# EAGLE design WidgetEsp8266RGBv4Panel (EAGLE 9.2.0)
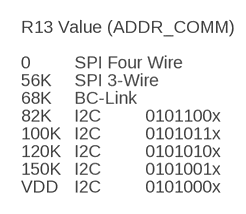
[diagram p0: schematic, sheet 1, part 1 of 3]
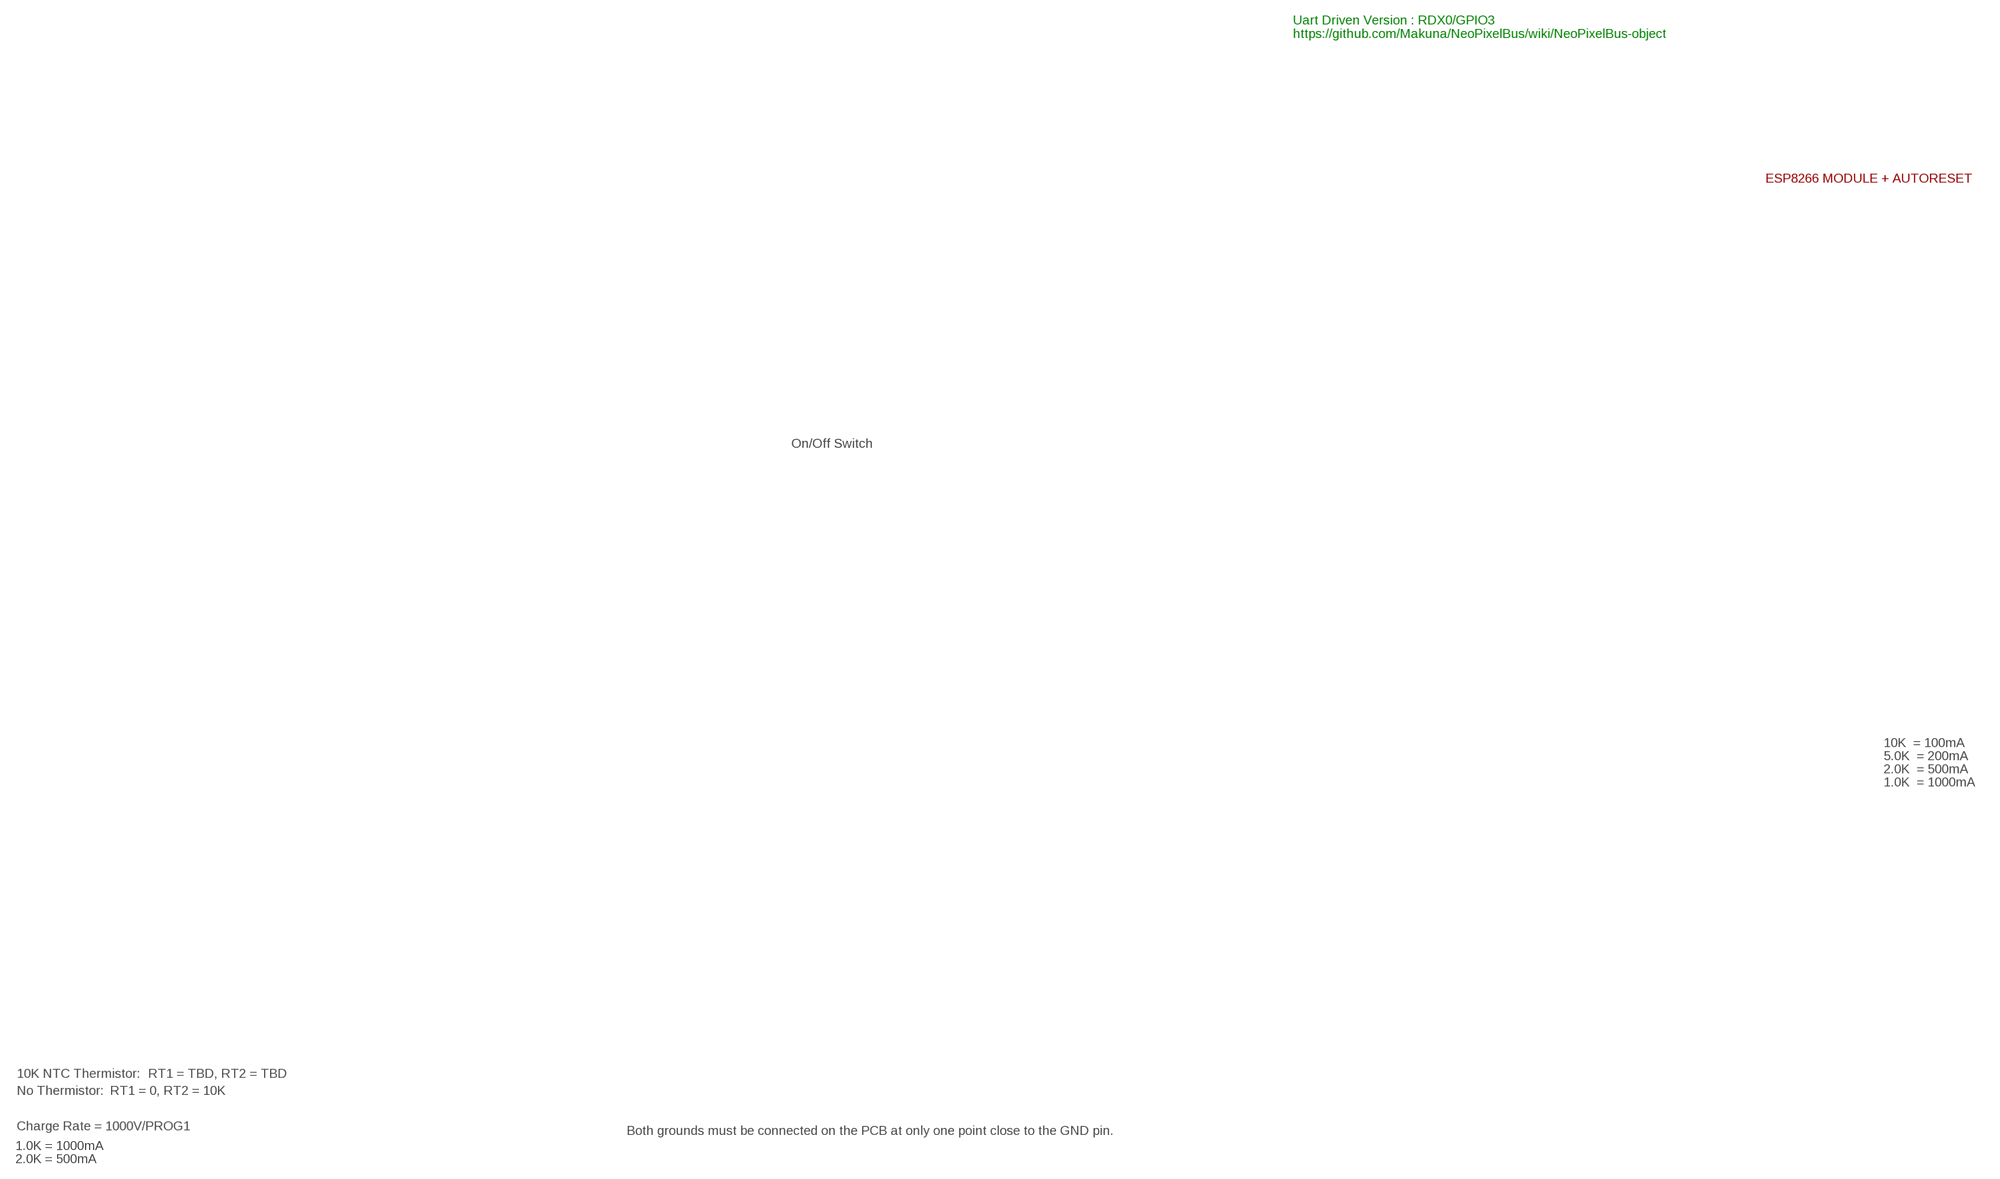
[diagram p1: schematic, sheet 1, part 2 of 3]
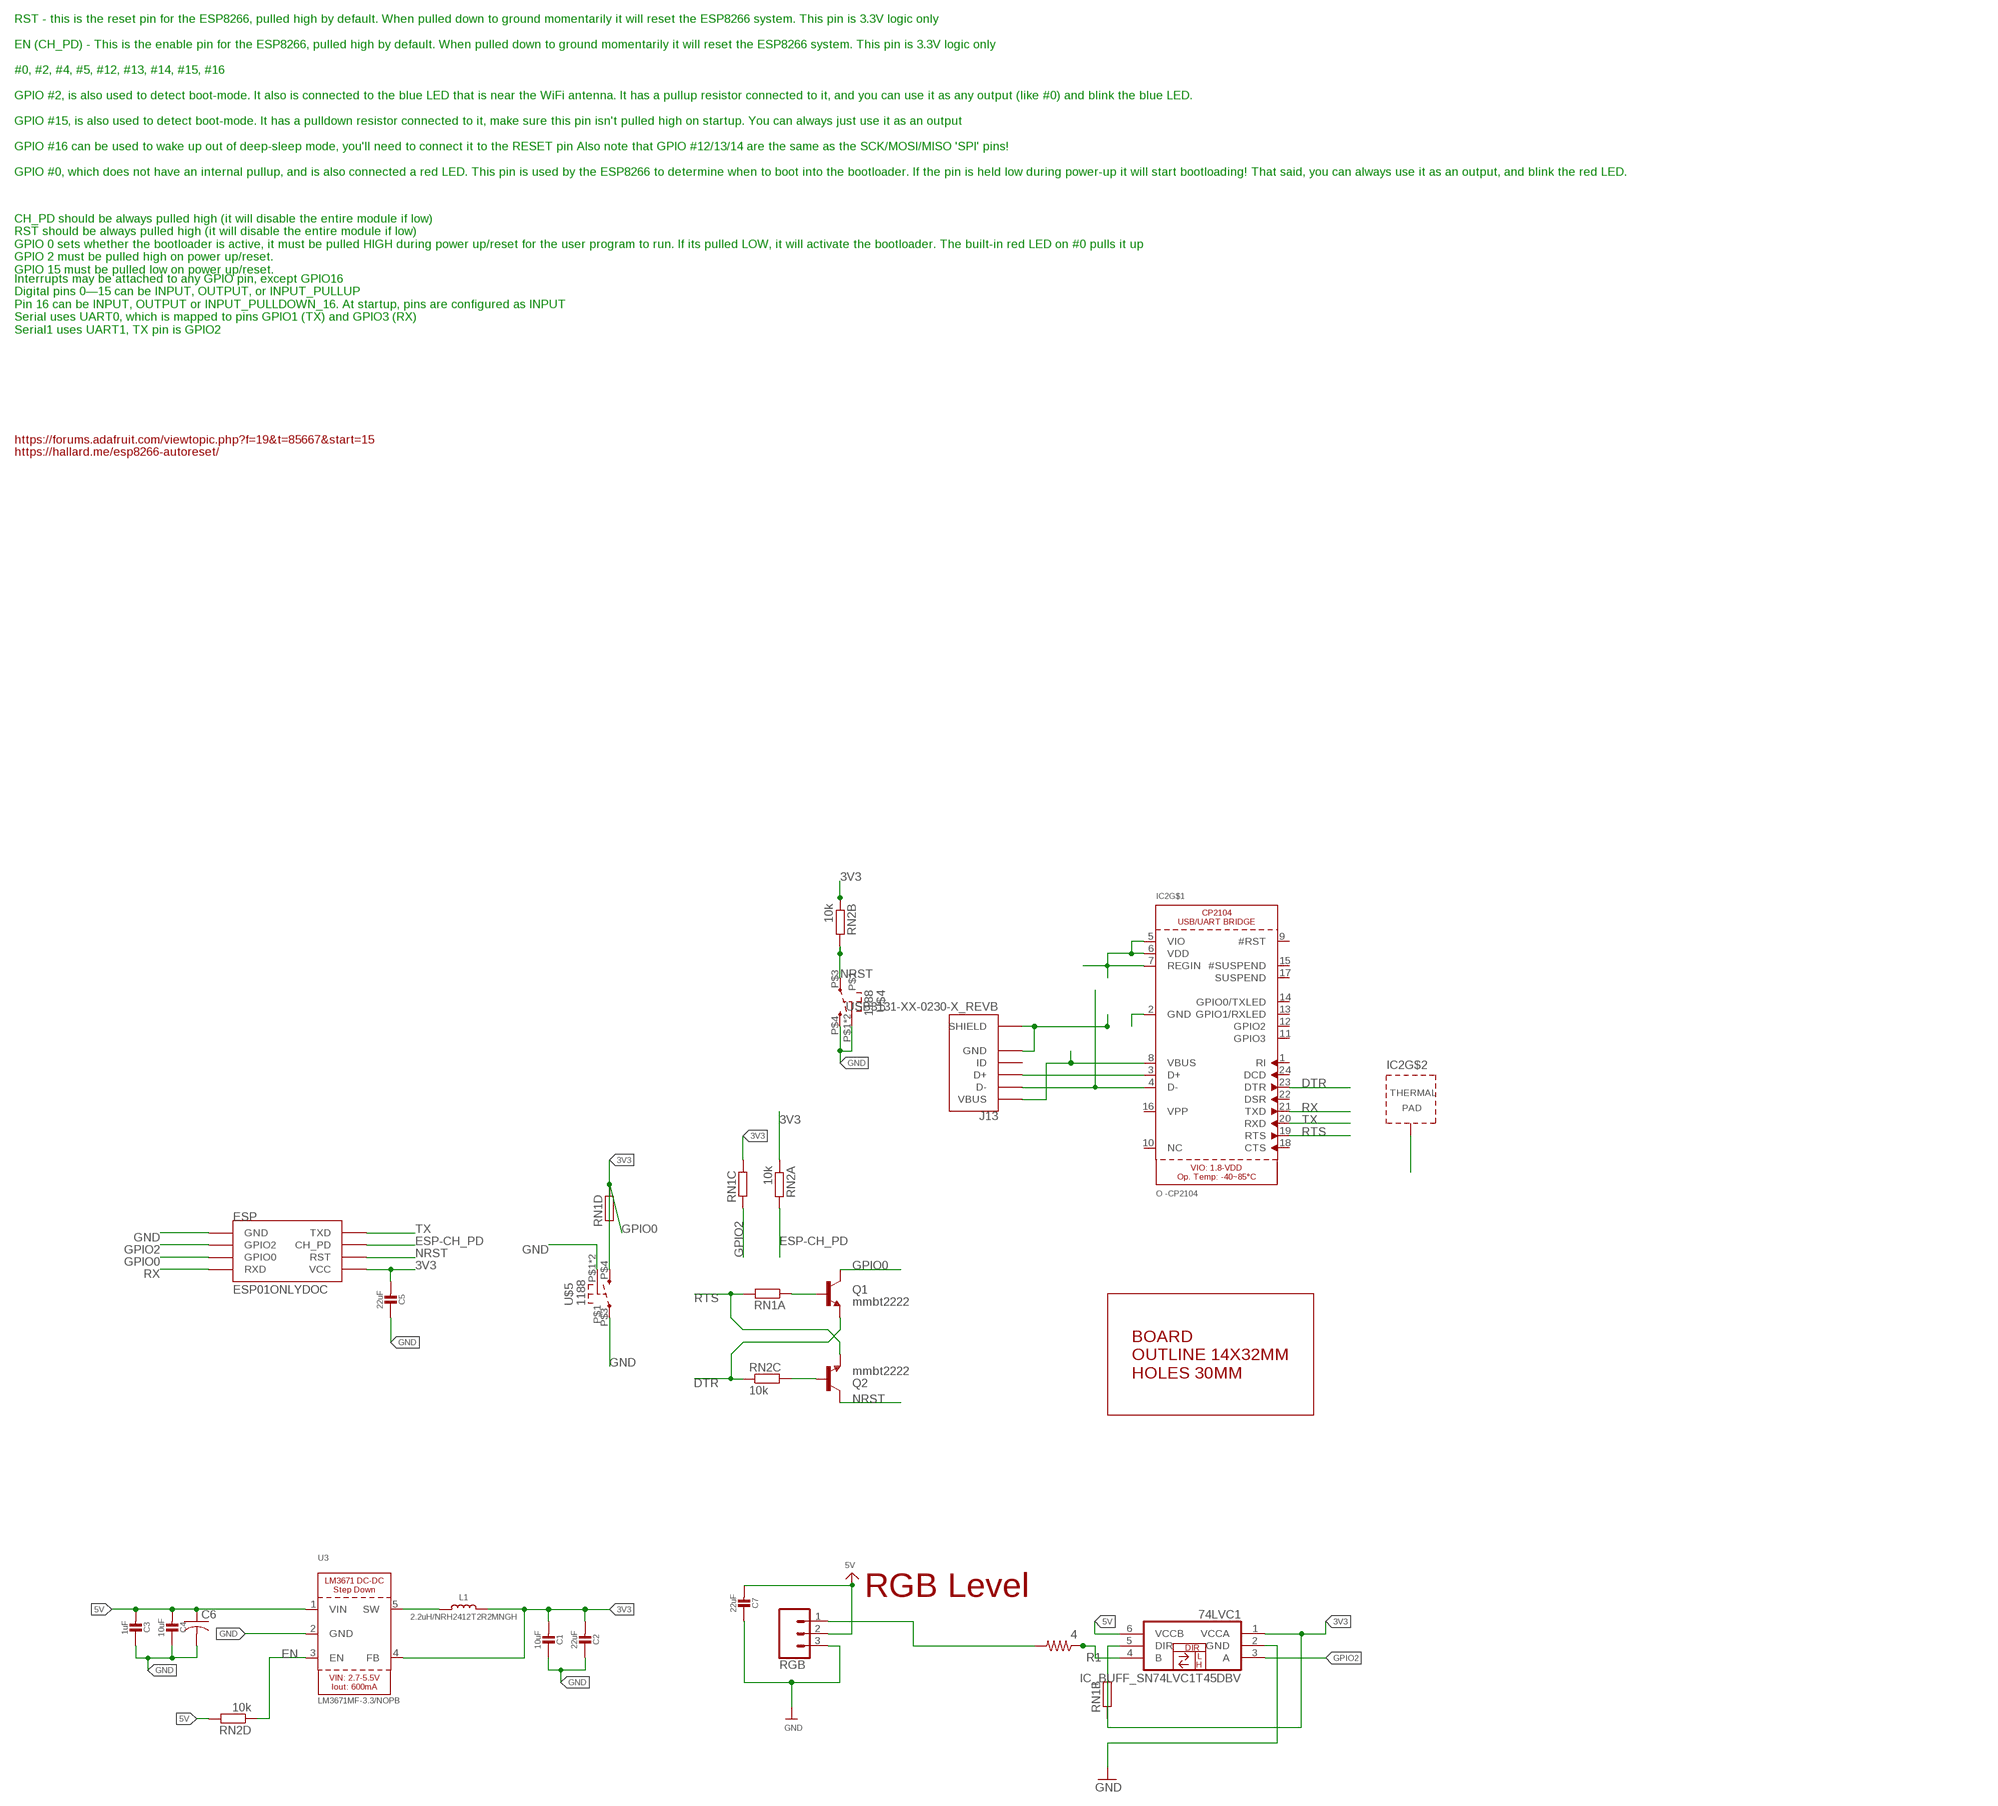
[diagram p2: schematic, sheet 1, part 3 of 3]

## Parts
74LVC1  IC_BUFF_SN74LVC1T45DBV  [DBV-R-PDSO-G6]
C1  10uF  CAP_CERAMIC0805-NOOUTLINE  [0805-NO]
C2  22uF  CAP_CERAMIC0805-NOOUTLINE  [0805-NO]
C3  1uF  CAP_CERAMIC0805-NOOUTLINE  [0805-NO]
C4  10uF  CAP_CERAMIC0805-NOOUTLINE  [0805-NO]
C5  22uF  CAP_CERAMIC0805-NOOUTLINE  [0805-NO]
C6  C-USC3225  [C3225]
C7  22uF  CAP_CERAMIC0805-NOOUTLINE  [0805-NO]
ESP  ESP01ONLYDOC  [ESP01-NONOSILK]
IC2  O -CP2104  CP2104  [QFN24_4MM_SMSC]
J13  USB3131-XX-0230-X_REVB  [GCT_USB3131-XX-0230-X_REVB]
L1  2.2uH/NRH2412T2R2MNGH  INDUCTORNRH2412T  [INDUCTOR_TAIYOYUDEN_NRH2412T]
Q1  mmbt2222  TRANSISTOR_NPNSOT23-3  [SOT23-3]
Q2  mmbt2222  TRANSISTOR_NPNSOT23-3  [SOT23-3]
R1  4  RESISTOR0805-RES  [0805]
RGB  CONN_03LONGPADS  [1X03_LONGPADS]
RN1  RESISTOR_ARRAY_4  [RN8P-4R-CRA06S]
RN2  10k  RESISTOR_ARRAY_4  [RN8P-4R-CRA06S]
U3  LM3671MF-3.3/NOPB  VREG_LM3671  [SOT23-5]
U$4  1188  [1188]
U$5  1188  [1188]
U$7  BOARD14X32  [14X32]

## Nets
3V3: 74LVC1.1(VCCA) C1.2 C2.2 C5.2 ESP.VCC IC2.5(VIO) IC2.6(VDD) IC2.7(REGIN) L1.2 RN1.4 RN1.6 RN1.7 RN2.1 RN2.2 U3.4(FB)
5V: 74LVC1.6(VCCB) C3.2 C4.2 C6.1 C7.2 IC2.8(VBUS) J13.1(VBUS) RGB.2 RN2.5 U3.1(VIN)
DTR: IC2.23(DTR) Q1.2(E) RN2.3
EN: RN2.4 U3.3(EN)
ESP-CH_PD: ESP.CH_PD RN2.8
ESP-USBMINUS3: IC2.4(D-) J13.2(D-)
ESP-USBPLUS3: IC2.3(D+) J13.3(D+)
GND: 74LVC1.2(GND) C1.1 C2.1 C3.1 C4.1 C5.1 C6.2 C7.1 ESP.GND IC2.2(GND) IC2.THERM(TP) J13.5(GND) J13.6(SHIELD) J13.7(SHIELD) RGB.3 U3.2(GND) U$4.P$1 U$4.P$2 U$4.P$4 U$5.P$1 U$5.P$2 U$5.P$3
GPIO0: ESP.GPIO0 Q1.3(C) RN1.5 U$5.P$4
GPIO2: 74LVC1.3(A) ESP.GPIO2 RN1.3
N$13: Q2.1(B) RN2.6
N$14: L1.1 U3.5(SW)
N$16: Q1.1(B) RN1.1
N$52: 74LVC1.5(DIR) RN1.2
N$74: 74LVC1.4(B) R1.1
NRST: ESP.RST Q2.3(C) RN2.7 U$4.P$3
RTS: IC2.19(RTS) Q2.2(E) RN1.8
RX: ESP.RX(RXD) IC2.21(TXD)
TO-RGB-TOP: R1.2 RGB.1
TX: ESP.TX(TXD) IC2.20(RXD)
Unconnected: IC2.1(RI) IC2.9(#RST) IC2.10(NC) IC2.11(GPIO3) IC2.12(GPIO2) IC2.13(GPIO1/RXLED) IC2.14(GPIO0/TXLED) IC2.15(#SUSPEND) IC2.16(VPP) IC2.17(SUSPEND) IC2.18(CTS) IC2.22(DSR) IC2.24(DCD) J13.4(ID)

## Notes on the sheet
- R13 Value (ADDR_COMM)
- 0 | SPI Four Wire
- 56K | SPI 3-Wire
- 68K | BC-Link
- 82K | I2C | 0101100x
- 100K | I2C | 0101011x
- 120K | I2C | 0101010x
- 150K | I2C | 0101001x
- VDD | I2C | 0101000x
- RST - this is the reset pin for the ESP8266, pulled high by default. When pulled down to ground momentarily it will reset the ESP8266 system. This pin is 3.3V logic only
  
  EN (CH_PD) - This is the enable pin for the ESP8266, pulled high by default. When pulled down to ground momentarily it will reset the ESP8266 system. This pin is 3.3V logic only 
  
  #0, #2, #4, #5, #12, #13, #14, #15, #16 
  
  GPIO #2, is also used to detect boot-mode. It also is connected to the blue LED that is near the WiFi antenna. It has a pullup resistor connected to it, and you can use it as any output (like #0) and blink the blue LED. 
  
  GPIO #15, is also used to detect boot-mode. It has a pulldown resistor connected to it, make sure this pin isn't pulled high on startup. You can always just use it as an output 
  
  GPIO #16 can be used to wake up out of deep-sleep mode, you'll need to connect it to the RESET pin Also note that GPIO #12/13/14 are the same as the SCK/MOSI/MISO 'SPI' pins! 
  
  GPIO #0, which does not have an internal pullup, and is also connected a red LED. This pin is used by the ESP8266 to determine when to boot into the bootloader. If the pin is held low during power-up it will start bootloading! That said, you can always use it as an output, and blink the red LED.
- CH_PD should be always pulled high (it will disable the entire module if low)
  RST should be always pulled high (it will disable the entire module if low)
  GPIO 0 sets whether the bootloader is active, it must be pulled HIGH during power up/reset for the user program to run. If its pulled LOW, it will activate the bootloader. The built-in red LED on #0 pulls it up
  GPIO 2 must be pulled high on power up/reset.
  GPIO 15 must be pulled low on power up/reset.
- Interrupts may be attached to any GPIO pin, except GPIO16 
  Digital pins 0—15 can be INPUT, OUTPUT, or INPUT_PULLUP
  Pin 16 can be INPUT, OUTPUT or INPUT_PULLDOWN_16. At startup, pins are configured as INPUT
  Serial uses UART0, which is mapped to pins GPIO1 (TX) and GPIO3 (RX)
  Serial1 uses UART1, TX pin is GPIO2
- https://forums.adafruit.com/viewtopic.php?f=19&t=85667&start=15
- https://hallard.me/esp8266-autoreset/
- Uart Driven Version : RDX0/GPIO3
  https://github.com/Makuna/NeoPixelBus/wiki/NeoPixelBus-object
- ESP8266 MODULE + AUTORESET
- On/Off Switch
- 10K  = 100mA
- 5.0K  = 200mA
- 2.0K  = 500mA
- 1.0K  = 1000mA
- RGB Level
- 10K NTC Thermistor: | RT1 = TBD, RT2 = TBD
- No Thermistor: | RT1 = 0, RT2 = 10K
- Charge Rate = 1000V/PROG1 | Both grounds must be connected on the PCB at only one point close to the GND pin.
- 1.0K = 1000mA
- 2.0K = 500mA

## Library data of the parts
74LVC1 = dp_devices:IC_BUFF_SN74LVC1T45DBV
C1-C5 C7 = microbuilder:CAP_CERAMIC: Ceramic Capacitors For new designs, use the packages preceded by an '_' character since they are more reliable: The following footprints should be used on most boards: _0402 - Standard footprint for regular board layouts _0603 - Standard footprint for regular board layouts _0805 - Standard footprint for regular board layouts _1206 - Standard footprint for regular board layouts For extremely tight-pitch boards where space is at a premium, the following 'micro-pitch' footprints can be used (smaller pads, no silkscreen outline, etc.): _0402MP - Micro-pitch footprint for very dense/compact boards _0603MP - Micro-pitch footprint for very dense/compact boards _0805MP - Micro-pitch footprint for very dense/compact boards _1206MP - Micro-pitch footprint for very dense/compact boards
C6 = adafruit:C-US: CAPACITOR, American symbol
ESP = esp8266modules:ESP01: ESP8266 Wifi module 01
IC2 = microbuilder:CP2104: CP2104 - USB to UART Bridge VDD Output: 3.45V
J13 = USB3131-XX-0230-X_REVB:USB3131-XX-0230-X_REVB: Micro USB Receptacle, Type B, Through-Hole, Vertical, With 2.30mm (Standart) Shell Stakes; AVAILABILITY: Good; DESCRIPTION: Micro B Skt%2C Vertical%2C TH%2C 30%C2%B5%22%2C With 2.3mm shell stake%2C T%26R; MF: Global Connector Technology; MP: USB3131-30-0230-A; PACKAGE: None; PRICE: 0.53 USD
L1 = microbuilder:INDUCTOR: Inductors 0603: 10nH Ceramic Inductor - microwire antenna/RF (Digikey: 712-1434-2-ND) 0805: 560nH Ceramic Inductor - RF (Digikey: 553-1047-1-ND) 270nH Ceramic Inductor - Q = 40@250MHz, +-5%, 1 Ohm DC Resistance (Digikey: 535-10506-2-ND) 1007 (2518 Metric) SMT: 10µH 10% 250mOhm 820mA 1007 Inductor (Digikey: 587-2189-1-ND) 22µH 10% 500mOhm 580mA 1007 Inductor (Digikey: 587-2190-1-ND) 47µH 10% 950mOhm 420mA 1007 Inductor (Digikey: 587-2191-1-ND) 47µH 5% 100mOhm 1A 1008 Inductor (Digikey: 732-1816-1-ND) 5.0x5.0mm (Taiyo Yuden NR5040 Series) 6.8µH 20% 2.3A 64mOhm Inductor (Digikey: 587-2374-2-ND) 5.0x5.0mm (TDK VLC5045 Series) 4.7µH 20% 3.3A 34mOhm Inductor (Digikey: 445-6526-1-ND) 6.8µH 20% 2.7A 46mOhm Inductor (Digikey: 445-6527-1-ND) 6.0x6.0mm (TDK VLC6045 Series) 4.7µH 20% 3.8A 27mOhm Inductor (Digikey: 445-6538-2-ND) 6.8µH 20% 3A 41mOhm Inductor (Digikey: 445-6540-1-ND) 6.2µH 30% 2.2A 45mOhm Inductor (Digikey: SRR5028-6R2YCT-ND) - Not TDK VLC6045 but footprint should match 6.0x6.0mm (TDK SLF6045 Series) 6.8uH 30% 2A 33mOhm Inductor (Digikey: 445-4572-1-ND, Mouser: 810-SLF645T6R8N2R0PF) 6.0x6.0mm (Sumida CDRH5D28 Series) 6.2uH 30% 1.8A 45mOhm Inductor (Digikey: 308-1542-1-ND) Taiyo Yuden NR3015T2R2M - 2.2uH 20% 1.5A (Digikey: 587-1648-2-ND, Mouser: 963-NR3015T2R2M) - Used with TI TPS62172 CoilCraft RFID Transponder Coil - MA5532-AE (For use with AS3935 Lightning Sensor) Taiyo Yuden NRH2412T2R2MNGH - 2.2uH 20% 1AA (Digikey: 587-3443-1-ND) - Used with TI LM3671 Vishay IHLP 1.0uH Molded Inductor - 24mOhm DCR, 5A, +/-20%, -55°C-125°C (Digikey: 541-1319-1-ND)
Q1 Q2 = SparkFun:TRANSISTOR_NPN: Transistor NPN BJT configuration in SOT23 package. MMBT2222 is the common NPN we use. Double check BCE configuration again layout.
R1 = SparkFun-Passives:RESISTOR: Resistor Basic schematic elements and footprints for 0603, 1206, and PTH resistors.
RGB = SparkFun-Connectors:CONN_03: Multi connection point. Often used as Generic Header-pin footprint for 0.1 inch spaced/style header connections On any of the 0.1 inch spaced packages, you can populate with these: Break Away Headers - Straight <https://www.sparkfun.com/products/116> (PRT-00116) Break Away Male Headers - Right Angle <https://www.sparkfun.com/products/553> (PRT-00553) Female Headers <https://www.sparkfun.com/products/115> (PRT-00115) Break Away Headers - Machine Pin <https://www.sparkfun.com/products/117> (PRT-00117) Break Away Female Headers - Swiss Machine Pin <https://www.sparkfun.com/products/743> (PRT-00743) Stackable Header - 3 Pin (Female, 0.1") <https://www.sparkfun.com/products/13875> (PRT-13875) For SCREWTERMINALS and SPRING TERMINALS visit here: Screw Terimnals on SparkFun.com <https://www.sparkfun.com/search/results?term=Screw+Terminals> (5mm/3.5mm/2.54mm spacing) This device is also useful as a general connection point to wire up your design to another part of your project. Our various solder wires solder well into these plated through hole pads. Hook-Up Wire - Assortment (Stranded, 22 AWG) <https://www.sparkfun.com/products/11375> (PRT-11375) Hook-Up Wire - Assortment (Solid Core, 22 AWG) <https://www.sparkfun.com/products/11367> (PRT-11367) View the entire wire category on our website here <https://www.sparkfun.com/categories/141> Special notes: Molex polarized connector foot print use with SKU : PRT-08232 with associated crimp pins and housings.
RN1 RN2 = dp_devices:RESISTOR_ARRAY_4: 4 Resistor Array 0603
U3 = microbuilder:VREG_LM3671: LM3671 - 600mA DC-DC Step-Down Converter VIN: 2.7-5.5V Load Current: 600mA Switching Frequency: 2MHz Iq: 16uA
U$4 U$5 = SwitchMax:1188
U$7 = MyBreadBoards:BOARD14X32

## Net classes
1 power: width 0.254 mm

## Board
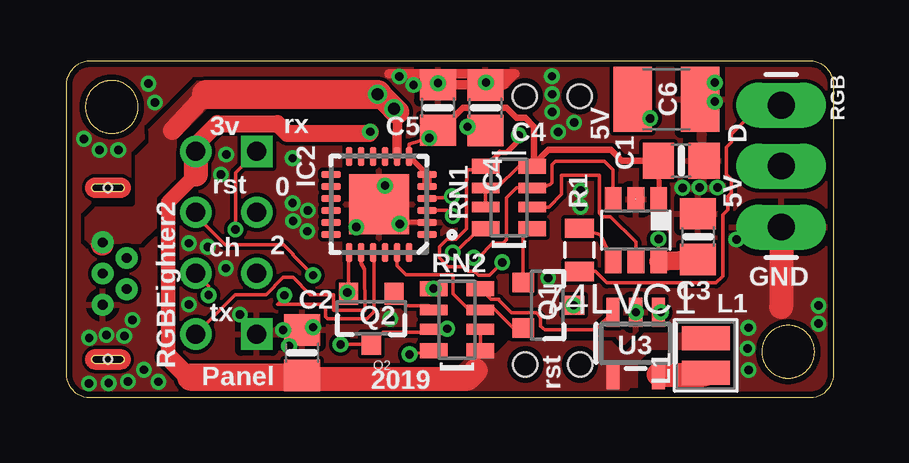
[diagram p3: board, top side]
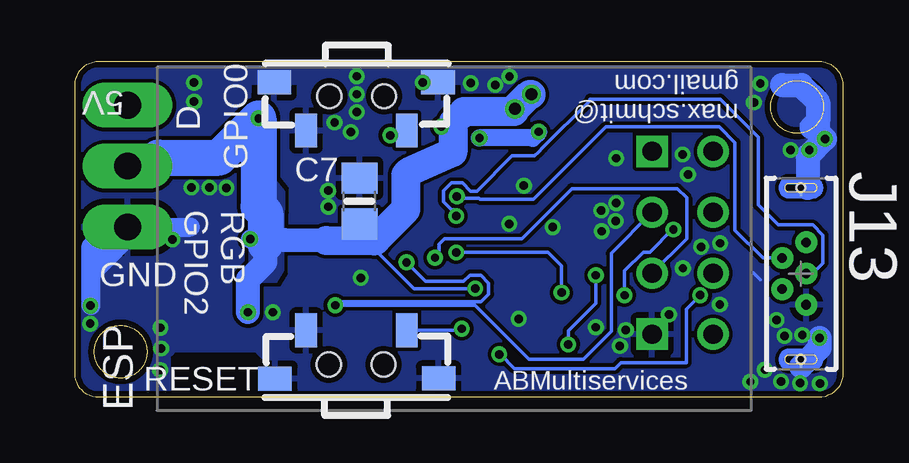
[diagram p4: board, bottom side, seen from below]

Size 32 x 14 mm. Coordinates in mm from the lower left corner, seen from the top.
Copper layers (1*16): Top 0.035mm / dielectric 1.5mm / Bottom 0.035mm
Design rules "dirt_cheap_dirty_boards.v1 *": minimum track width 6mil, minimum drill 12mil, track to track 6mil, track to pad 6mil, pad to pad 6mil, via to via 6mil, smd to smd 0mil, copper to edge 10mil, drill to drill 10mil, minimum pad ring 10mil, minimum via ring 6mil, stop-mask expansion 2mil, vias tented up to drill 25mil, thermal gap 10mil

### Footprints (pad centres in the part's own frame; a part is rotated, then mirrored left to right if it is on the bottom)
DBV-R-PDSO-G6 = smd 0.69 x 0.99: 1 -0.95,-1.29; 2 0,-1.29; 3 0.95,-1.29; 4 0.95,1.3; 5 0,1.3; 6 -0.95,1.3
0805-NO = smd 1.3 x 1.5: 1 -0.95,0; 2 0.95,0
C3225 = smd 1.6 x 2.7: 1 -1.4,0; 2 1.4,0
ESP01-NONOSILK = drill 0.8: CH_PD -1.285,-8.178; GPIO0 1.255,-5.638; GPIO2 -1.285,-5.638; RST 1.255,-8.178; TX -3.825,-8.178; VCC 3.795,-8.178 | drill 0.8 square: GND -3.825,-5.638; RX 3.795,-5.638
QFN24_4MM_SMSC = smd 0.8 x 0.28: 1 -2,1.25; 2 -2,0.75; 3 -2,0.25; 4 -2,-0.25; 5 -2,-0.75; 6 -2,-1.25; 13 2,-1.25; 14 2,-0.75; 15 2,-0.25; 16 2,0.25; 17 2,0.75; 18 2,1.25 | smd 0.28 x 0.8: 7 -1.25,-2; 8 -0.75,-2; 9 -0.25,-2; 10 0.25,-2; 11 0.75,-2; 12 1.25,-2; 19 1.25,2; 20 0.75,2; 21 0.25,2; 22 -0.25,2; 23 -0.75,2; 24 -1.25,2 | smd 2.5 x 2.5: THERM 0,0
GCT_USB3131-XX-0230-X_REVB = drill 0.4 pad 0.9: 1 -1.3,0.22; 2 -0.65,-0.78; 3 0,0.22; 4 0.65,-0.78; 5 1.3,0.22 | smd 0.1 x 0.1: 6 -3.275,0; 7 3.875,0 | hole 0.35: -3.575,0; 3.575,0
INDUCTOR_TAIYOYUDEN_NRH2412T = smd 1 x 2: 1 -0.725,0; 2 0.725,0
SOT23-3 = smd 0.8 x 0.9: 1 -0.95,-1; 2 0.95,-1; 3 0,1.1
0805 = smd 0.8 x 1.2: 1 -0.9,0; 2 0.9,0
1X03_LONGPADS = drill 1.118 pad 1.88 long: 1 0,0; 2 2.54,0; 3 5.08,0
RN8P-4R-CRA06S = smd 0.63 x 1.15: 1 -1.295,-0.975; 4 1.295,-0.975; 5 1.295,0.975; 8 -1.295,0.975 | smd 0.44 x 1.15: 2 -0.4,-0.975; 3 0.4,-0.975; 6 0.4,0.975; 7 -0.4,0.975
SOT23-5 = smd 0.55 x 1.2: 1 -0.95,-1.3; 2 0,-1.3; 3 0.95,-1.3; 4 0.95,1.3; 5 -0.95,1.3
1188 = smd 1.4 x 1: P$1 -3.39,-0.07; P$2 3.44,-0.06 | smd 0.9 x 1.4: P$3 2.11,1.95; P$4 -2.09,1.95 | hole 1: -1.14,0.52; 1.14,0.52

### Placement (x,y rotation side)
74LVC1  23.75,6.97 180 top
C1  25.64,9.86 180 top
C2  9.83,1.86 270 top
C3  26.34,6.7 270 top
C4  17.48,12.07 270 top
C5  15.5,12.08 270 top
C6  25.02,12.42 0 top
C7  20.15,8.18 270 bottom
ESP  13.58,6.46 90 bottom
IC2  13.04,8.04 180 top
J13  1.74,5.16 270 bottom
L1  26.66,1.75 90 top
Q1  20.05,3.84 270 top
Q2  12.72,3.32 180 top
R1  21.39,6.15 270 top
RGB  29.81,12.18 270 top
RN1  18.46,8.33 90 top
RN2  16.29,3.24 90 top
U3  23.74,2.25 180 top
U$4  20.28,0.85 0 bottom
U$5  20.26,13.07 180 bottom
U$7  32,0.04 0 bottom

### Tracks (layer width: path | path; a pad name or v marks a point on that pad's centre or on a via)
3V3  (via drill 0.35)
  Top 0.152: IC2.7 14.3,10.55 v15.14,10.81 C5.2 | RN1.7 RN1.6 17.96,8.73 18.87,9.64 18.89,9.62 RN1.4 | RN2.2 RN2.1 17.08,1.12
  Top 0.2: IC2.6 IC2.7 | C5.2 15.61,11.13 | C1.2 74LVC1.1 | 19.51,9.7 RN1.4
  Top 0.28: 15.61,11.13 16.55,12.06 18.36,12.06 18.77,11.65 19.14,11.65 19.51,11.28 19.51,9.7 | C1.2 23.18,9.86 22.72,10.32 20.1,10.32 19.44,9.65 RN1.4
  Top 0.4: IC2.5 IC2.6
  Top 0.6: 5.4,9.28 4.25,8.13
  Top 0.61: 4.25,8.13 4.25,1.7
  Top 0.7: v12.67,11.07 12.64,11 9.22,11 8.81,11.41 6.3,11.41 5.4,10.51 ESP.VCC
  Top 0.813: 5.16,0.78 5.13,0.81 4.25,1.7
  Top 1: 17.08,1.12 16.74,0.78 5.16,0.78 | C2.2 5.22,0.91 5.13,0.81 | ESP.VCC 5.4,9.28
  Bottom 0.7: v12.67,11.07 12.67,11.05 12.93,10.79 12.93,10.81 v15.14,10.81
  pour Top (no thermals): 16.34,0.38 16.34,1.25 16.88,1.79 17.91,1.79 18.43,2.31 22.72,2.31 23.24,1.79 24.1,2.65 26.42,2.65 26.42,2.18 26.27,2.03 25.13,2.03 24.38,2.03 24.1,1.75 23.79,1.44 23.79,0.44 23.51,0.44 23.4,0.33 16.45,0.33 16.38,0.4
5V  (via drill 0.35, 0.5)
  Top 0.152: v24.35,11.63 23.62,12.35 C6.1 | 74LVC1.6 v24.69,6.6 | C4.2 v16.73,11.27 | U3.1 v24.79,3.55
  Top 0.4: 13.81,11.89 IC2.8
  Top 0.8: C3.2 74LVC1.6 | 4.43,11.12 5.84,12.63
  Top 0.9: 1.48,6.36 1.52,6.36 J13.1
  Top 1: v12.98,12.63 13.07,12.63 13.81,11.89 13.8,11.89 v13.67,12.02
  Top 1.2: 5.84,12.63 v12.98,12.63
  Bottom 0.152: v15.32,4.53 17.88,4.53 19.46,6.11 19.46,6.53 19.46,6.59 | 24.06,6.4 23.27,6.56 | v16.73,11.27 16.44,11.12 | v24.79,3.55 24.79,3.8 | RGB.2 30.25,9.64 30.43,9.46
  Bottom 0.2: 16.44,11.12 16.39,11.12 16.25,11.25 16.25,11.44 16.24,11.45
  Bottom 0.8: v12.98,12.63 13.7,11.91 | v24.69,6.6 24.26,6.6 24.06,6.4
  Bottom 1: 23.27,6.56 21.52,6.54 | C7.2 19.61,6.53 | v24.79,3.55 24.79,4.91 24.06,5.64 24.06,6.4
  Bottom 1.2: 16.24,11.45 15.79,11.91 13.7,11.91 | 19.46,6.59 18.22,7.83 18.22,9.26 18.08,9.4 16.25,10.21 16.25,11.25 | 21.52,6.54 19.61,6.53 19.52,6.53 19.46,6.53 | v13.67,12.02 13.06,12.63 v12.98,12.63
  Bottom 1.5: 24.06,6.4 24.06,7.67 24.35,7.96 v24.35,11.63 25.99,9.99 28.52,9.99 29.04,9.47 30.43,9.46
  pour Bottom (no thermals): 23.31,7.03 23.29,8.56 23.94,9.38 24.63,9.4 24.6,7.68 24.22,7.18 24.25,6.45 24.62,6.18 24.72,6.09 24.73,4.81 23.9,4.81 23.61,4.81 23.32,5.3 23.3,7.01
  pour Top (no thermals): 4.25,10.72 4.24,10.73 4.24,11.05
  pour Top (no thermals): 1.57,6.41 1.6,6.44 3.09,6.44 3.73,7.08 3.73,8.33 4.52,9.12 4.52,10.79 4.1,11.21 4.08,11.21 2.91,10.04 2.91,8.22 2.91,8.05 2.92,8.04 2.78,7.9 1.88,7.9 1.24,7.9 1.23,7.91 0.81,7.49 0.81,6.6 1,6.41
  pour Top: 3.47,10.28 3.47,11.13 3.45,11.15 5.46,13.16 5.87,13.16 5.87,12.12 5.9,12.09 4.56,10.75 4.56,10.33 4.48,10.25 3.47,10.25
DTR
  Top 0.152: IC2.23 13.79,5.48 14.16,5.11 16.12,5.11 16.12,4.32 16.81,3.64 RN2.3 17.4,3.77 17.76,3.77 18.64,2.89 Q1.2
EN
  Top 0.152: RN2.4 17.71,4.09 18.04,4.09 18.04,4.04 18.56,3.52 19.6,3.52 19.77,3.35 19.77,2.97 19.95,2.81 22.05,2.81 U3.3
ESP-CH_PD  (via drill 0.35)
  Top 0.152: ESP.CH_PD 5.94,4.64 v5.94,4.26 | v14.32,1.79 RN2.8
  Bottom 0.152: v5.94,4.26 6.52,3.68 6.52,1.45 9.25,1.45 9.49,1.2 13.68,1.2 14.26,1.79 v14.32,1.79
ESP-USBMINUS3  (via drill 0.35)
  Top 0.152: v16.08,8.38 16.01,8.31 15.17,8.31 IC2.4
  Bottom 0.152: 15.16,8.29 15.17,8.29 | 15.17,8.29 16,8.29 v16.08,8.38 | 15.17,8.29 15.11,8.25 12.88,8.25 9.86,11.27 5.14,11.27 4.49,10.62 4.49,6.97 3.33,5.81 J13.2
ESP-USBPLUS3  (via drill 0.35)
  Top 0.152: IC2.3 15.87,7.8 v16.11,7.56
  Bottom 0.152: J13.3 1.27,5.15 0.82,5.6 0.82,6.76 1.25,7.19 2.68,7.19 3.52,8.02 3.52,10.84 5.1,12.43 10.53,12.43 10.53,12.37 12.51,10.39 12.66,10.22 12.68,10.22 12.84,10.06 13.79,10.06 15.25,8.6 15.51,8.6 15.85,8.93 16.31,8.93 16.64,8.61 16.64,8.15 16.31,7.82 16.19,7.82 16.11,7.74 v16.11,7.56
GND  (via drill 0.35)
  Top 0.152: IC2.THERM 13.69,7.44 | C2.1 10.18,2.81 v10.29,2.92
  Top 0.2: IC2.2 13.79,7.29 13.64,7.44 13.69,7.44 v13.9,7.23
  Top 0.4: C5.1 18.25,13.03 18.71,13.49 13.47,13.49
  Top 0.6: 13.04,8.57 v13.29,8.82
  Top 1: 26.71,12.71 C6.2 | IC2.THERM 13.04,8.34 12.63,8.75 12.63,8.45 IC2.THERM | IC2.THERM 13.04,8.57 | RGB.3 29.81,3.77
  Bottom 0.152: 3.73,5.19 3.44,4.9 | 1.45,11.4 1.46,11.41 1.72,11.41 1.62,11.51 | 1.62,11.51 1.45,11.68 1.45,12.5 1.2,12.75 | 1.02,11.51 1.62,11.51 | 1.6,8.77 1.62,8.78 | J13.6 1.46,8.72 1.6,8.77 | 1.6,8.77 1.45,8.92
  Bottom 0.2: 1.29,11.24 1.45,11.4
  Bottom 0.8: RGB.3 27.2,7.1 | 31.35,5.13 31.35,3.82 | 31.35,5.13 31.35,6.28 30.63,6.28 RGB.3 | RGB.3 29.81,6.66 31.35,5.13
  Bottom 1: J13.7 0.96,2.06 v0.96,2.48 | 1.02,11.51 1.29,11.24 | 1.02,11.51 1.02,12.31 1.72,13.01 2.52,13.01 | 1.02,11.51 1.02,11.05 v0.74,10.77 1.46,10.05 1.46,8.72
  other vias: 9.46,7.35 9.44,9.96 6.67,10.12 10.07,7.79 9.29,2.14 6.66,5.38 5.9,6.27 3.43,13.07 12.09,7.09 2.57,0.66 3.85,0.65 2.42,2.55 1.77,0.59 0.95,0.58 20.09,4.98 21.45,8.61 20.51,11.06 13.51,3.27 9.04,2.81 7.24,3.45 23.75,3.55 21.44,7.94 31.36,3.82 27.04,13.11 25.69,8.73 20.26,11.89 20.26,12.63 5.12,3.87 5.11,6.42 3.24,1.15 3.7,12.28 9.44,8.09 21.18,11.45 27.94,6.58 28.44,2.9 28.41,2.03 2.76,3.22 1.68,2.6 1.39,10.31 2.17,10.31 6.45,9.29 10.05,6.92 15.5,13.09 17.5,13.12 20.25,13.38 28.45,1.14 31.37,3.07 27.04,12.32 26.4,8.74 27.15,8.74 13.89,13.37 14.48,13.01
  pour Top (rank 2): -3.88,16.56 -3.88,-2.49 -0.07,-6.3 31.68,-6.3 37.19,-0.79 37.19,12.32 31.68,17.83 -2.61,17.83
  pour Bottom (rank 2): -2.61,19.1 -2.61,-2.49 -0.07,-5.03 31.68,-5.03 35.49,-1.22 35.49,15.29 31.68,19.1
  pour Bottom (no thermals): 15.83,13.67 15.83,13.26 15.82,13.25 17.86,13.25 17.95,13.34 17.95,13.68 17.91,13.72 15.87,13.72 15.82,13.67
  pour Bottom (no thermals): 22.64,13.65 22.64,13.24 22.63,13.23 24.67,13.23 24.76,13.32 24.76,13.66 24.72,13.7 22.68,13.7 22.63,13.65
GPIO0  (via drill 0.35)
  Top 0.152: v18.18,5.63 17.64,5.09 17.18,5.09 17.01,5.26 16.76,5.26 16.58,5.45 15.84,5.45 15.84,5.52 15.55,5.81 15.55,6.27 15.88,6.59 16.25,6.59 16.68,7.03 16.68,9.04 16.7,9.06 16.7,9.49 17.35,9.49 RN1.5
  Top 0.2: RN1.5 18.08,10.22 18.38,10.22 18.86,10.7 v18.86,10.92
  Bottom 0.152: ESP.GPIO0 9.65,6 9.65,2.75 10.81,1.59 13.08,1.59 15.33,3.84 Q1.3 21.01,3.98 15.09,3.98 14.76,4.3 14.76,4.76 15.09,5.09 15.55,5.09 15.8,4.84 17.39,4.84 v18.18,5.63
  Bottom 0.2: v18.86,10.92 18.37,10.92 U$5.P$4
  other vias: 21.15,3.84
GPIO2  (via drill 0.35)
  Top 0.152: v17,5.82 17.18,5.82 17.78,6.41 18.2,6.41 18.36,6.57 18.36,8.31 18.78,8.73 RN1.3 19.86,8.73 20.19,8.89 20.24,8.94 20.24,9.7 20.39,9.85 22.43,9.85 22.8,9.48 74LVC1.3
  Bottom 0.152: v17,5.82 16.82,5.99 16.82,6.39 16.59,6.62 13.37,6.62 11.29,8.7 6.89,8.7 6.5,8.31 6.5,6.61 ESP.GPIO2
N$13
  Top 0.152: RN2.6 15.14,3.82 14.16,3.82 Q2.1
N$14
  Top 1: U3.5 26.59,0.95 L1.1
N$16
  Top 0.152: RN1.1 19.05,6.65 Q1.1
N$52
  Top 0.152: RN1.2 20.12,7.93 20.65,8.46 20.65,9.25 22.23,9.25 22.23,7.67 22.36,7.53 22.69,7.53 23.75,6.48 74LVC1.5
N$74
  Top 0.152: 74LVC1.4 22.27,6.77 R1.1
NOGND
  cutout Top: 24.25,0.28 24.25,1.57 24.5,1.82 27.81,1.82 27.95,1.68 27.95,0.25 27.81,0.11 24.32,0.11 24.26,0.17 24.26,0.24
  cutout Bottom: 24.25,0.28 24.25,1.57 24.5,1.82 27.81,1.82 27.95,1.68 27.95,0.25 27.81,0.11 24.32,0.11 24.26,0.17 24.26,0.24
NRST  (via drill 0.35)
  Top 0.152: v11.44,2.21 v11.45,2.22 Q2.3 13.21,2.71 15.19,2.71 RN2.7 15.86,2.84 v15.88,2.86 | v10.29,5.09 9.45,5.93 9.45,5.97 9.06,6.36 6.62,6.36 4.95,8.03 5.09,8.03 ESP.RST
  Bottom 0.152: v10.29,5.09 10.29,3.93 11.44,2.78 v11.44,2.21 | v15.88,2.86 15.94,2.8 U$4.P$3
RTS  (via drill 0.35)
  Top 0.152: IC2.19 11.77,6.02 Q2.2 | v16.11,6.04 16.23,6.04 17.23,7.03 RN1.8 | Q2.2 v11.72,4.37 | Q2.2 11.45,3.99 11.45,3.94 Q2.2
  Bottom 0.152: v16.11,6.04 12.28,6.04 11.72,5.48 v11.72,4.37
RX  (via drill 0.35)
  Top 0.152: IC2.21 12.84,5.98 12.84,3.57 12.55,3.27 11.02,3.27 10.9,3.28 10.82,3.36 10.82,3.69 10.63,3.88 8.82,3.88 9.09,4.15 v9.09,4.26 | v7.06,7 7.06,9.37 ESP.RX
  Bottom 0.152: v9.09,4.26 9.09,5.27 8.31,6.06 8.04,6.06 7.07,7.03 7.07,7.01 v7.06,7
TO-RGB-TOP
  Top 0.152: R1.2 22.06,5.25 22.54,4.77 27.09,4.77 27.37,5.05 27.37,7.62 27.58,7.83 27.58,8.39 27.73,8.53 27.73,9.09 27.52,9.3 27.52,10.42 27.73,10.63 27.73,10.96 28.94,12.18 RGB.1
TX
  Top 0.152: ESP.TX 7.05,4.28 8.33,4.28 9.05,5 9.45,5 10.17,4.28 11.14,4.28 11.14,3.63 12.45,3.63 12.45,5.34 12.29,5.59 IC2.20

### Text on the board
tPlace: RGBFighter2
bPlace: max.schmit@ / gmail.com | 5V | D | GPIO0 | RGB / GPIO2 | GND | RESET | ABMultiservices
tNames: 3v | rx | 5V | D | rst | 0 | 5V | ch | 2 | GND | tx | Panel | 2019 | rst